# EAGLE design metrowing (EAGLE 8.4.0)
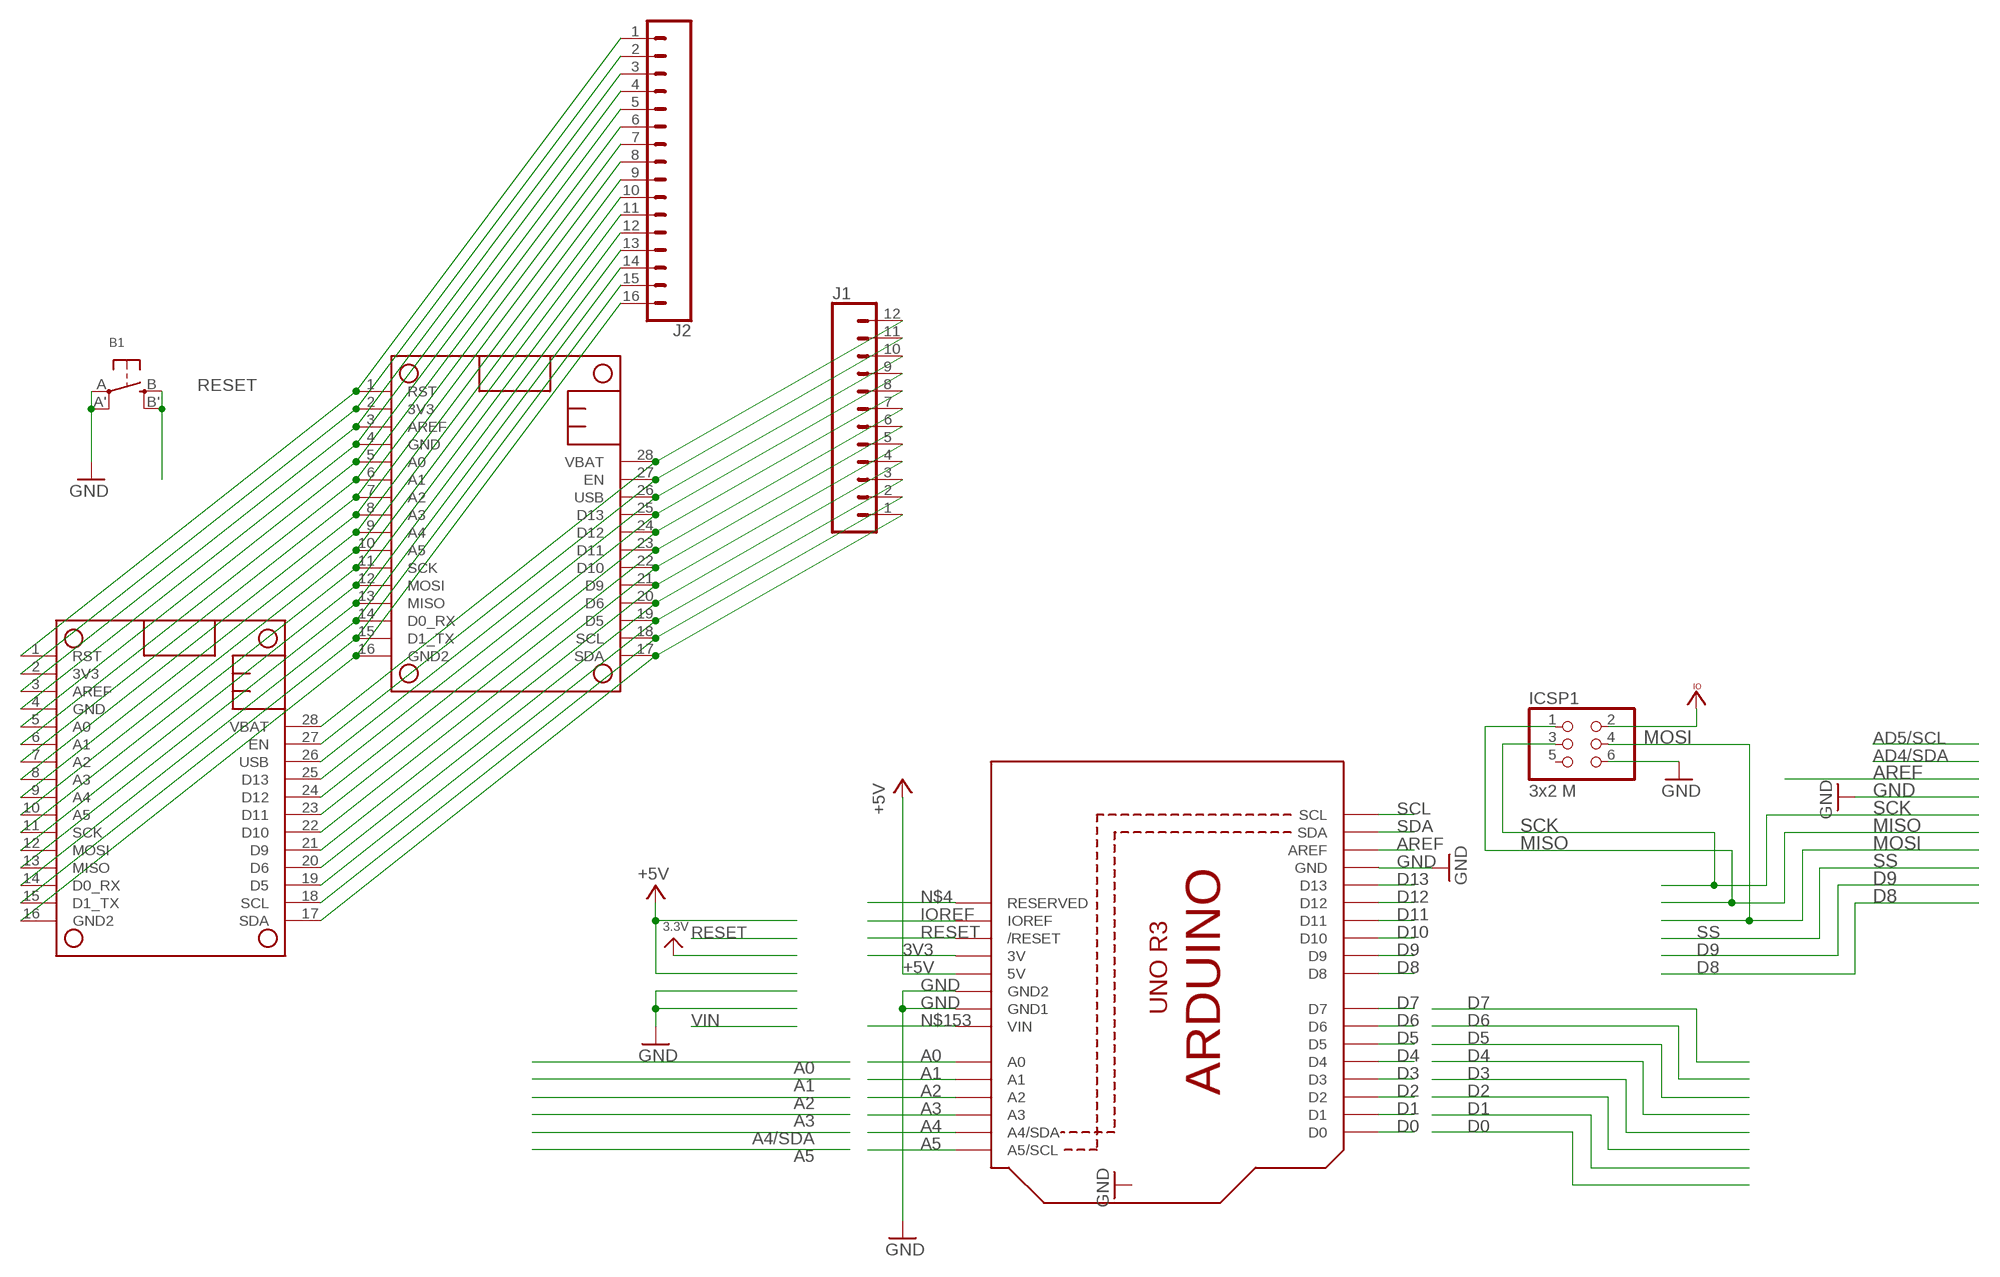
[diagram p0: schematic, sheet 1]

## Parts
B1  SWITCH_TACT_SMT  [EVQ-Q2]
ICSP1  3x2 M  HEADER-2X3  [2X03_ROUND_70MIL]
J1  CONN_12  [1X12]
J2  CONN_16  [1X16]
MS1  FEATHERWING_PINS  [FEATHERWING_PINS]
MS2  FEATHERWING_PINS  [FEATHERWING_PINS]
U1  ARDUINOR3-DIMENSION  [ARDUINOR3]

## Nets
3V3: J2.2 MS1.2(3V3) MS2.2(3V3) U1.3V ; supply symbol labelled 3.3V
+5V: J1.10 MS1.26(USB) MS2.26(USB) U1.5V
A0: J2.5 MS1.5(A0) MS2.5(A0) U1.A0
A1: J2.6 MS1.6(A1) MS2.6(A1) U1.A1
A2: J2.7 MS1.7(A2) MS2.7(A2) U1.A2
A3: J2.8 MS1.8(A3) MS2.8(A3) U1.A3
A4: J2.9 MS1.9(A4) MS2.9(A4) U1.A4(A4/SDA)
A5: J2.10 MS1.10(A5) MS2.10(A5) U1.A5(A5/SCL)
AREF: J2.3 MS1.3(AREF) MS2.3(AREF) U1.AREF
D0: J2.14 MS1.14(D0_RX) MS2.14(D0_RX) U1.D0
D1: J2.15 MS1.15(D1_TX) MS2.15(D1_TX) U1.D1
D2: U1.D2
D3: U1.D3
D4: U1.D4
D5: J1.3 MS1.19(D5) MS2.19(D5) U1.D5
D6: J1.4 MS1.20(D6) MS2.20(D6) U1.D6
D7: U1.D7
D8: U1.D8
D9: J1.5 MS1.21(D9) MS2.21(D9) U1.D9
D10: J1.6 MS1.22(D10) MS2.22(D10) U1.D10
D11: J1.7 MS1.23(D11) MS2.23(D11) U1.D11
D12: J1.8 MS1.24(D12) MS2.24(D12) U1.D12
D13: J1.9 MS1.25(D13) MS2.25(D13) U1.D13
ENABLE: J1.11 MS1.27(EN) MS2.27(EN)
GND: B1.A'(P1) B1.A(P) ICSP1.6 J2.4 J2.16 MS1.4(GND) MS1.16(GND2) MS2.4(GND) MS2.16(GND2) U1.GND U1.GND1 U1.GND2
IOREF: U1.IOREF
MISO: ICSP1.1 J2.13 MS1.13(MISO) MS2.13(MISO)
MOSI: ICSP1.4 J2.12 MS1.12(MOSI) MS2.12(MOSI)
N$4: U1.RESERVED
N$153: U1.VIN
RESET: B1.B'(S1) B1.B(S) J2.1 MS1.1(RST) MS2.1(RST) U1.RESET(/RESET)
SCK: ICSP1.3 J2.11 MS1.11(SCK) MS2.11(SCK)
SCL: J1.2 MS1.18(SCL) MS2.18(SCL) U1.SCL
SDA: J1.1 MS1.17(SDA) MS2.17(SDA) U1.SDA
VBAT: J1.12 MS1.28(VBAT) MS2.28(VBAT)
VCCIO [usbvcc]: ICSP1.2
Unconnected: ICSP1.5

## Library data of the parts
B1 = microbuilder:SWITCH_TACT_SMT: SMT Tact Switches 6x6mm - Digikey: P12940SCT-ND KMR2 (4.6x2.8mm) - Digikey: 401-1426-1-ND EVQ-PQHB55 - Light Touch, 160GF (4.5x4.5mm) - Digikey: P8090SCT-ND
ICSP1 = microbuilder:HEADER-2X3: PIN HEADER
J1 = SparkFun-Connectors:CONN_12: Multi connection point. Often used as Generic Header-pin footprint for 0.1 inch spaced/style header connections On any of the 0.1 inch spaced packages, you can populate with these: Break Away Headers - Straight <https://www.sparkfun.com/products/116> (PRT-00116) Break Away Male Headers - Right Angle <https://www.sparkfun.com/products/553> (PRT-00553) Female Headers <https://www.sparkfun.com/products/115> (PRT-00115) Break Away Headers - Machine Pin <https://www.sparkfun.com/products/117> (PRT-00117) Break Away Female Headers - Swiss Machine Pin <https://www.sparkfun.com/products/743> (PRT-00743) For SCREWTERMINALS and SPRING TERMINALS visit here: Screw Terimnals on SparkFun.com <https://www.sparkfun.com/search/results?term=Screw+Terminals> (5mm/3.5mm/2.54mm spacing) This device is also useful as a general connection point to wire up your design to another part of your project. Our various solder wires solder well into these plated through hole pads. Hook-Up Wire - Assortment (Stranded, 22 AWG) <https://www.sparkfun.com/products/11375> (PRT-11375) Hook-Up Wire - Assortment (Solid Core, 22 AWG) <https://www.sparkfun.com/products/11367> (PRT-11367) View the entire wire category on our website here <https://www.sparkfun.com/categories/141> Special notes: Molex polarized connector foot print use with SKU : PRT-08231 with associated crimp pins and housings. 1MM SMD Version SKU: PRT-10208 NOTES ON THE VARIANTS LOCK and LOCK_LONGPADS... This footprint was designed to help hold the alignment of a through-hole component (i.e. 6-pin header) while soldering it into place. You may notice that each hole has been shifted either up or down by 0.005 of an inch from it's more standard position (which is a perfectly straight line). This slight alteration caused the pins (the squares in the middle) to touch the edges of the holes. Because they are alternating, it causes a "brace" to hold the component in place. 0.005 has proven to be the perfect amount of "off-center" position when using our standard breakaway headers. Although looks a little odd when you look at the bare footprint, once you have a header in there, the alteration is very hard to notice. Also,if you push a header all the way into place, it is covered up entirely on the bottom side.
J2 = SparkFun-Connectors:CONN_16: Multi connection point. Often used as Generic Header-pin footprint for 0.1 inch spaced/style header connections On any of the 0.1 inch spaced packages, you can populate with these: Break Away Headers - Straight <https://www.sparkfun.com/products/116> (PRT-00116) Break Away Male Headers - Right Angle <https://www.sparkfun.com/products/553> (PRT-00553) Female Headers <https://www.sparkfun.com/products/115> (PRT-00115) Break Away Headers - Machine Pin <https://www.sparkfun.com/products/117> (PRT-00117) Break Away Female Headers - Swiss Machine Pin <https://www.sparkfun.com/products/743> (PRT-00743) For SCREWTERMINALS and SPRING TERMINALS visit here: Screw Terimnals on SparkFun.com <https://www.sparkfun.com/search/results?term=Screw+Terminals> (5mm/3.5mm/2.54mm spacing) This device is also useful as a general connection point to wire up your design to another part of your project. Our various solder wires solder well into these plated through hole pads. Hook-Up Wire - Assortment (Stranded, 22 AWG) <https://www.sparkfun.com/products/11375> (PRT-11375) Hook-Up Wire - Assortment (Solid Core, 22 AWG) <https://www.sparkfun.com/products/11367> (PRT-11367) View the entire wire category on our website here <https://www.sparkfun.com/categories/141> Special notes: Molex polarized connector foot print use with SKU : PRT-08231 with associated crimp pins and housings. 1MM SMD Version SKU: PRT-10208 NOTES ON THE VARIANTS LOCK and LOCK_LONGPADS... This footprint was designed to help hold the alignment of a through-hole component (i.e. 6-pin header) while soldering it into place. You may notice that each hole has been shifted either up or down by 0.005 of an inch from it's more standard position (which is a perfectly straight line). This slight alteration caused the pins (the squares in the middle) to touch the edges of the holes. Because they are alternating, it causes a "brace" to hold the component in place. 0.005 has proven to be the perfect amount of "off-center" position when using our standard breakaway headers. Although looks a little odd when you look at the bare footprint, once you have a header in there, the alteration is very hard to notice. Also,if you push a header all the way into place, it is covered up entirely on the bottom side.
MS1 MS2 = 00_bsiepert:FEATHERWING
U1 = 00_bsiepert:ARDUINOR3: This is a new object for the new Arduino R3 - with extra pins that you may want to use (such as IOref, and duplicated A4/A5

## Net classes
1 power: width 0.305 mm, drill 0.483 mm, clearance 0.203 mm
2 gnd: width 0.305 mm, drill 0.483 mm, clearance 0.203 mm
3 usbvcc: width 0.61 mm, drill 0.483 mm, clearance 0.203 mm
4 aref: width 0.254 mm, drill 0.483 mm, clearance 0.203 mm

## Board
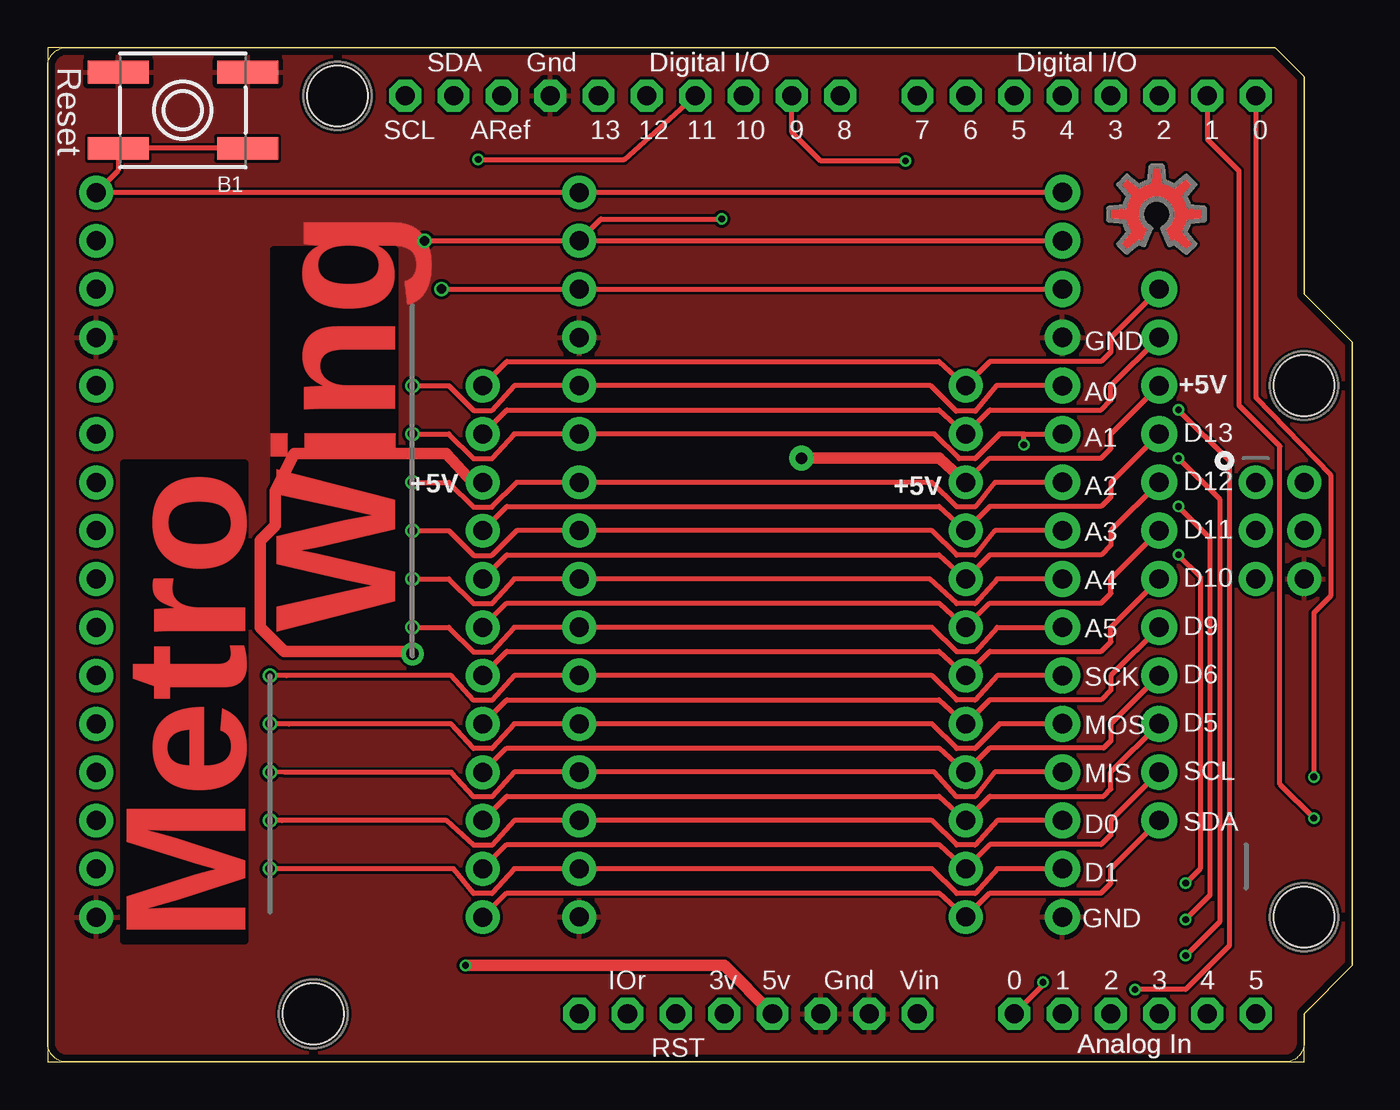
[diagram p1: board, top side]
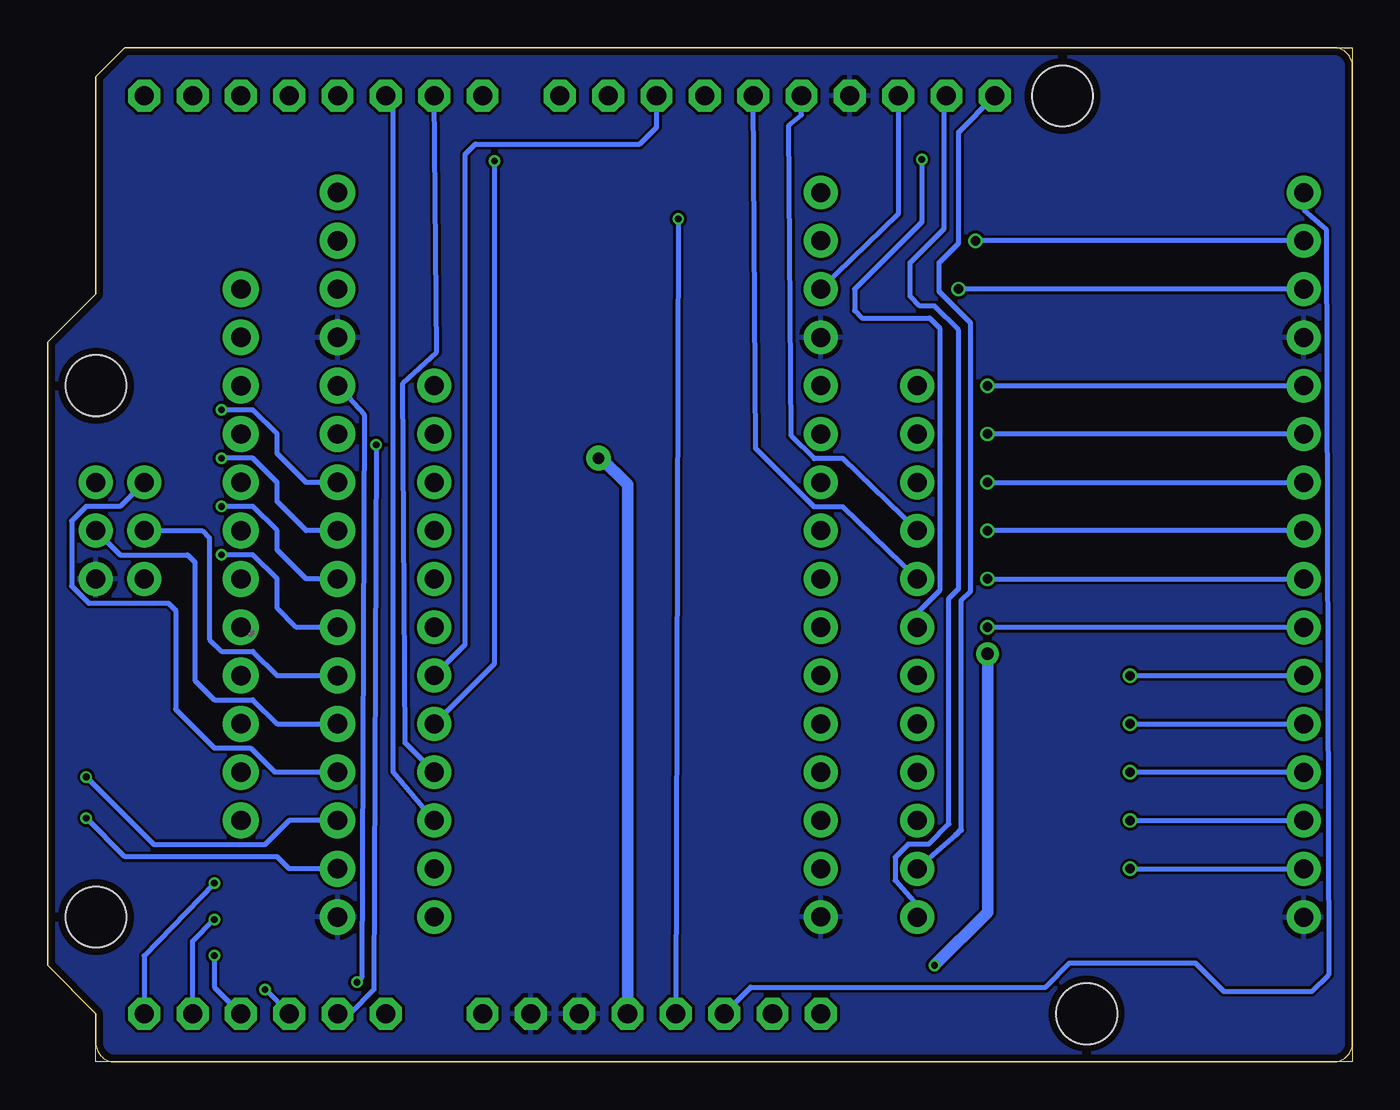
[diagram p2: board, bottom side, seen from below]

Size 68.58 x 53.34 mm. Coordinates in mm from the lower left corner, seen from the top.
Outline: 64.52,53.34 66.04,51.82 66.04,40.39 68.58,37.85 68.58,5.08 66.04,2.54 66.04,1 arc-90 65.04,0 1,0 arc-90 0,1 0,52.34 arc-90 1,53.34 64.52,53.34
Copper layers (1*16): Top 0.035559375mm / dielectric 1.6mm / Bottom 0.035559375mm
Design rules "oshpark-2layer-tented": minimum track width 6mil, minimum drill 10mil, track to track 6mil, track to pad 6mil, pad to pad 6mil, via to via 6mil, smd to smd 6mil, copper to edge 15mil, drill to drill 6mil, minimum pad ring 5mil, minimum via ring 5mil, stop-mask expansion 2.5mil, vias tented up to drill 20mil, thermal gap 10mil
Holes 3.2 mm at 66.04,35.56 66.04,7.62 15.24,50.8 13.97,2.54

### Footprints (pad centres in the part's own frame; a part is rotated, then mirrored left to right if it is on the bottom)
EVQ-Q2 = smd 3.2 x 1.2: A -3.4,-2; A' 3.4,-2; B -3.4,2; B' 3.4,2
2X03_ROUND_70MIL = drill 1 pad 1.778: 1 -2.54,-1.27; 2 -2.54,1.27; 3 0,-1.27; 4 0,1.27; 5 2.54,-1.27; 6 2.54,1.27
1X12 = drill 1.016 pad 1.88: 1 0,0; 2 2.54,0; 3 5.08,0; 4 7.62,0; 5 10.16,0; 6 12.7,0; 7 15.24,0; 8 17.78,0; 9 20.32,0; 10 22.86,0; 11 25.4,0; 12 27.94,0
1X16 = drill 1.016 pad 1.88: 1 0,0; 2 2.54,0; 3 5.08,0; 4 7.62,0; 5 10.16,0; 6 12.7,0; 7 15.24,0; 8 17.78,0; 9 20.32,0; 10 22.86,0; 11 25.4,0; 12 27.94,0; 13 30.48,0; 14 33.02,0; 15 35.56,0; 16 38.1,0
FEATHERWING_PINS = drill 1 pad 1.778: 1 6.35,1.27; 2 8.89,1.27; 3 11.43,1.27; 4 13.97,1.27; 5 16.51,1.27; 6 19.05,1.27; 7 21.59,1.27; 8 24.13,1.27; 9 26.67,1.27; 10 29.21,1.27; 11 31.75,1.27; 12 34.29,1.27; 13 36.83,1.27; 14 39.37,1.27; 15 41.91,1.27; 16 44.45,1.27; 17 44.45,21.59; 18 41.91,21.59; 19 39.37,21.59; 20 36.83,21.59; 21 34.29,21.59; 22 31.75,21.59; 23 29.21,21.59; 24 26.67,21.59; 25 24.13,21.59; 26 21.59,21.59; 27 19.05,21.59; 28 16.51,21.59
ARDUINOR3 = drill 1 pad 1.676 octagon: 3V 35.56,2.54; 5V 38.1,2.54; A0 50.8,2.54; A1 53.34,2.54; A2 55.88,2.54; A3 58.42,2.54; A4 60.96,2.54; A5 63.5,2.54; AREF 23.876,50.8; D0 63.5,50.8; D1 60.96,50.8; D2 58.42,50.8; D3 55.88,50.8; D4 53.34,50.8; D5 50.8,50.8; D6 48.26,50.8; D7 45.72,50.8; D8 41.656,50.8; D9 39.116,50.8; D10 36.576,50.8; D11 34.036,50.8; D12 31.496,50.8; D13 28.956,50.8; GND 26.416,50.8; GND1 43.18,2.54; GND2 40.64,2.54; IOREF 30.48,2.54; RESERVED 27.94,2.54; RESET 33.02,2.54; SCL 18.796,50.8; SDA 21.336,50.8; VIN 45.72,2.54

### Placement (x,y rotation side)
B1  7.11,50.04 180 top
ICSP1  64.77,27.94 270 top
J1  58.42,12.7 90 top
J2  53.34,45.72 270 top
MS1  1.28,52.06 270 top
MS2  26.67,52.07 270 top
U1  0,0 0 top
U$1  [OSHWLOGO_TOP_0.2]  58.29,44.58 0 top

### Tracks (layer width: path | path; a pad name or v marks a point on that pad's centre or on a via)
3V3  (via drill 0.35, 0.5)
  Top 0.254: MS2.2 27.81,43.17 | MS2.2 J2.2 | MS2.2 29.08,44.32 v35.43,44.32 | v19.81,43.18 MS2.2
  Bottom 0.254: v35.43,44.32 U1.3V | MS1.2 v19.81,43.17 v19.81,43.18
+5V  (via drill 0.35, 0.6 pad 1.3, 0.65 pad 1.2)
  Top 0.254: MS2.26 49.53,31.75 55.37,31.75 55.88,32.26 55.88,33.02 J1.10
  Top 0.61: MS2.26 46.86,31.75 v39.62,31.75 | U1.5V 35.56,5.08 v21.97,5.08 | MS1.26 22.36,30.48 20.95,32 12.95,32 11.96,30.02 11.96,28.22 11.18,27.43 11.18,22.86 12.45,21.59 19.05,21.59 v19.18,21.46
  Bottom 0.152: 39.5,31.75 v39.62,31.75
  Bottom 0.61: U1.5V 38.1,30.35 39.5,31.75 | v21.97,5.08 19.18,7.87 v19.18,21.46
A0  (via drill 0.35, 0.5)
  Top 0.254: J2.5 49.86,35.56 48.77,34.21 47.76,34.21 46.41,35.56 MS2.5 24.53,35.56 23.35,34.26 22.39,34.26 21.09,35.56 v19.18,35.56 | v52.32,4.19 52.32,4.06 U1.A0
  Bottom 0.254: J2.5 51.94,34.04 52.07,4.45 v52.32,4.19 | v19.18,35.56 MS1.5
A1  (via drill 0.35, 0.5)
  Top 0.254: 51.31,33.02 J2.6 | 51.31,33.02 50.04,33.02 48.74,31.73 47.9,31.73 46.61,33.02 MS2.6 24.53,33.02 23.35,31.72 22.39,31.72 21.09,33.02 v19.18,33.02 | v51.31,32.46 51.31,33.02
  Bottom 0.254: U1.A1 52.7,2.54 51.44,3.81 v51.31,32.46 | MS1.6 v19.17,33.02 v19.18,33.02
A2  (via drill 0.35, 0.5)
  Top 0.254: J2.7 49.78,30.48 48.74,29.18 47.78,29.18 46.48,30.48 MS2.7 24.65,30.48 23.35,29.18 22.39,29.18 21.09,30.48 v19.18,30.48 | v59.44,34.29 62.1,31.62 62.1,6.1 59.82,3.81 v57.15,3.81
  Bottom 0.254: 53.47,30.35 J2.7 54.99,30.48 56.52,32 56.52,33.02 57.78,34.29 v59.44,34.29 | v57.15,3.81 U1.A2 | v19.18,30.48 MS1.7
A3  (via drill 0.35, 0.5)
  Top 0.254: J2.8 49.78,27.94 48.74,26.64 47.78,26.64 46.48,27.94 MS2.8 24.65,27.94 23.35,26.64 22.39,26.64 21.09,27.94 v19.18,27.94 | v59.44,31.75 61.59,29.59 61.59,7.37 v59.82,5.59
  Bottom 0.254: J2.8 54.99,27.94 56.52,29.46 56.52,30.48 57.78,31.75 v59.44,31.75 | v59.82,5.59 59.82,3.94 U1.A3 | MS1.8 v19.17,27.93 v19.18,27.94
A4  (via drill 0.35, 0.5)
  Top 0.254: J2.9 49.91,25.4 48.74,24.11 47.78,24.11 46.35,25.4 MS2.9 24.53,25.4 23.35,24.1 22.39,24.1 21.09,25.4 v19.18,25.4 | v59.44,29.21 61.09,27.56 61.09,8.76 v59.82,7.49
  Bottom 0.254: J2.9 54.99,25.4 56.52,26.92 56.52,27.94 57.78,29.21 v59.44,29.21 | v59.82,7.49 60.96,6.35 U1.A4 | v19.18,25.4 MS1.9
A5  (via drill 0.35, 0.5)
  Top 0.254: J2.10 49.91,22.86 48.74,21.57 47.78,21.57 46.48,22.86 MS2.10 24.53,22.86 23.35,21.56 22.39,21.56 21.09,22.86 v19.18,22.86 | v59.44,26.67 60.58,25.53 60.58,10.16 v59.82,9.4
  Bottom 0.254: 63.5,2.67 U1.A5 63.5,5.59 v59.82,9.4 | J2.10 55.5,22.86 56.52,23.88 56.52,25.4 57.78,26.67 v59.44,26.67 | MS1.10 v19.17,22.86 v19.18,22.86
AREF  (via drill 0.5)
  Top 0.254: MS1.3 | J2.3 MS2.3 v20.7,40.64
  Bottom 0.254: U1.AREF 23.88,44.58 MS2.3 | MS1.3 19.43,40.64 v20.7,40.64
D0  (via drill 0.35, 0.5)
  Top 0.254: J2.14 49.91,12.7 48.74,11.4 47.78,11.4 46.48,12.7 MS2.14 24.53,12.7 23.35,11.4 22.39,11.4 20.96,12.7 12.32,12.7 v11.68,12.7 | U1.D0 63.5,34.92 67.44,30.86 67.44,24.51 66.55,23.62 v66.55,14.99
  Bottom 0.254: J2.14 55.88,12.7 57.15,11.43 62.99,11.43 v66.55,14.99 | v11.68,12.7 MS1.14
D1  (via drill 0.35, 0.5)
  Top 0.254: J2.15 49.91,10.16 48.74,8.87 47.78,8.87 46.48,10.16 MS2.15 24.53,10.16 23.35,8.86 22.39,8.86 21.34,10.15 12.45,10.15 v11.68,10.16 | U1.D1 60.96,48.51 62.61,46.86 62.61,34.54 64.77,32.38 64.77,14.61 v66.55,12.83
  Bottom 0.254: J2.15 55.88,10.16 56.52,10.79 64.52,10.79 v66.55,12.83 | v11.68,10.16 MS1.15
D5
  Top 0.254: MS1.19 24.14,13.97 46.86,13.97 MS2.19 49.53,13.97 55.5,13.97 55.88,14.35 55.88,15.24 J1.3
  Bottom 0.254: MS2.19 50.42,15.24 50.42,50.04 U1.D5
D6
  Top 0.254: MS1.20 24.14,16.51 46.86,16.51 MS2.20 49.53,16.51 55.5,16.51 55.88,16.89 55.88,17.78 J1.4
  Bottom 0.254: U1.D6 48.13,37.34 49.91,35.69 49.78,16.76 MS2.20
D9  (via drill 0.35)
  Top 0.254: MS1.21 24.14,19.05 46.86,19.05 MS2.21 49.53,19.05 55.37,19.05 55.88,19.56 55.88,20.32 J1.5 | v45.09,47.37 40.64,47.37 39.12,48.9 U1.D9
  Bottom 0.254: MS2.21 45.09,20.95 v45.09,47.37
D10
  Top 0.254: MS1.22 24.14,21.59 46.86,21.59 MS2.22 49.53,21.59 55.37,21.59 55.88,22.1 55.88,22.86 J1.6
  Bottom 0.254: MS2.22 46.63,21.95 46.63,47.73 46.1,48.26 37.47,48.26 36.58,49.15 U1.D10
D11  (via drill 0.35)
  Top 0.254: MS1.23 24.14,24.13 46.86,24.13 MS2.23 49.53,24.13 55.37,24.13 55.88,24.64 55.88,25.4 J1.7 | v22.63,47.45 30.31,47.45 U1.D11
  Bottom 0.254: MS1.23 22.87,23.62 21.7,24.78 21.7,38.59 22.23,39.12 25.78,39.12 26.16,39.5 26.16,40.64 22.63,44.17 v22.63,47.45
D12
  Top 0.254: MS1.24 24.14,26.67 46.86,26.67 MS2.24 49.53,26.67 55.37,26.67 55.88,27.18 55.88,27.94 J1.8
  Bottom 0.254: MS1.24 26.79,29.18 28.3,29.18 31.37,32.26 U1.D12
D13
  Top 0.254: MS1.25 24.14,29.21 46.86,29.21 MS2.25 49.53,29.21 55.37,29.21 55.88,29.72 55.88,30.48 J1.9
  Bottom 0.254: U1.D13 28.96,49.78 29.62,49.25 29.49,32.92 28.3,31.73 26.79,31.73 MS1.25
ENABLE
  Top 0.254: MS1.27 24.14,34.29 46.86,34.29 MS2.27 49.53,34.29 55.37,34.29 55.88,34.8 55.88,35.56 J1.11
GND
  Top 0.254: MS1.4
  pour Bottom: 72.39,54.74 72.9,55.24 72.9,1.27 71.37,-0.25 -0.25,-0.76 -1.14,-0.13 -2.03,0.64 -1.65,52.83 0.89,54.74
  pour Top: 0.13,54.99 66.42,54.99 69.09,52.32 69.09,-0.25 68.33,-1.02 -0.89,-1.02 -2.41,0.51 -2.41,52.96
MISO  (via drill 0.5)
  Top 0.254: J2.13 49.78,15.24 48.74,13.95 47.78,13.95 46.61,15.24 MS2.13 24.53,15.24 23.35,13.94 22.39,13.94 21.22,15.23 12.45,15.23 v11.68,15.24
  Bottom 0.254: ICSP1.1 64.77,29.21 66.55,29.21 67.31,28.45 67.31,25.02 67.21,24.92 66.42,24.13 62.23,24.13 61.85,23.75 61.85,18.54 59.82,16.51 57.91,16.51 56.64,15.24 J2.13 | v11.68,15.24 MS1.13
MOSI  (via drill 0.5)
  Top 0.254: J2.12 50.04,17.78 48.74,16.48 47.78,16.48 46.48,17.78 MS2.12 24.53,17.78 23.35,16.48 22.39,16.48 21.22,17.77 12.7,17.77 v11.68,17.78
  Bottom 0.254: ICSP1.4 64.77,26.67 61.21,26.67 60.83,26.29 60.83,20.07 59.82,19.05 57.78,19.05 56.52,17.78 J2.12 | v11.68,17.78 MS1.12
RESET
  Top 0.254: J2.1 MS2.1 27.81,45.72 MS1.1 3.71,46.88 B1.B' B1.B
  Bottom 0.254: MS1.1 2.55,44.83 1.38,43.79 1.25,4.59 2.14,3.7 6.75,3.7 8.26,5.21 14.86,5.21 16.13,3.94 31.62,3.94 U1.RESET
SCK  (via drill 0.5)
  Top 0.254: J2.11 49.91,20.32 48.74,19.02 47.78,19.02 46.48,20.32 MS2.11 24.53,20.32 23.35,19.02 22.39,19.02 21.22,20.32 12.57,20.32 v11.68,20.32
  Bottom 0.254: ICSP1.3 60.45,27.94 60.07,27.56 60.07,22.23 59.44,21.59 57.78,21.59 56.52,20.32 J2.11 | v11.68,20.32 MS1.11
SCL
  Top 0.254: MS1.18 24.14,11.43 46.86,11.43 MS2.18 49.53,11.43 55.37,11.43 55.88,11.94 55.88,12.7 J1.2
  Bottom 0.254: 20.83,11.94 MS1.18 | 20.57,12.2 20.57,24.26 20.07,24.77 20.07,38.86 21.72,40.51 21.72,42.04 20.7,43.05 20.7,48.9 U1.SCL
  Bottom 0.305: 20.57,12.2 20.83,11.94
SDA
  Top 0.254: MS1.17 24.14,8.89 46.86,8.89 MS2.17 49.53,8.89 55.37,8.89 55.88,9.4 55.88,10.16 J1.1
  Bottom 0.254: MS1.17 22.87,8.25 24.04,9.54 24.04,10.77 23.35,11.45 22.28,11.45 21.21,12.52 21.21,24.38 20.7,24.89 20.7,38.48 21.97,39.75 22.73,39.75 23.24,40.26 23.24,42.04 21.46,43.81 21.46,50.67 U1.SDA
VBAT
  Top 0.254: MS1.28 24.14,36.83 46.86,36.83 MS2.28 49.53,36.83 55.37,36.83 55.88,37.34 55.88,38.1 | J1.12 55.88,38.1 | 55.88,38.1 55.88,37.97

### Text on the board
Top: Wing | Metro
tPlace: Reset | Digital I/O | Digital I/O | GND | A0 | +5V | D13 | A1 | +5V | +5V | A2 | D12 | D11 | A3 | A4 | D10 | A5 | D9 | SCK | D6 | MOS | D5 | MIS | SCL | D0 | SDA | D1 | GND | Analog In
tStop: Wing | Metro
214bmp: D:/SmartProjects/Snc/a4_bn_logo2.bmp